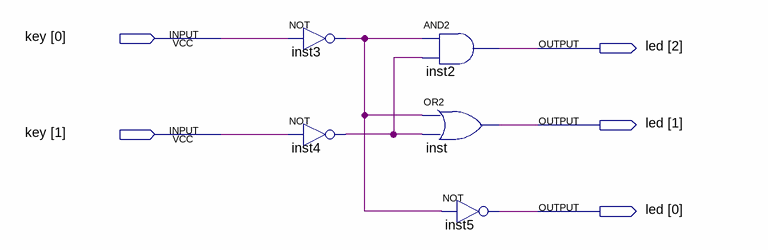
[diagram p0: schematic sheet]
// Quartus schematic lab1.bdf as structural Verilog: 5 symbols, 5 pins
module lab1 (
  input  [1:0] key,
  output [2:0] led
);

  wire inst3_out, inst4_out;

  not inst3 (inst3_out, key[0]);
  not inst4 (inst4_out, key[1]);
  and inst2 (led[2], inst3_out, inst4_out);
  or inst (led[1], inst3_out, inst4_out);
  not inst5 (led[0], inst3_out);
endmodule
